# Altium schematic sheet BBB-Headers.SchDoc: Set in Document Options » Parameters » Title
size Tabloid; Author: Set in Document Options » Parameters » Author + Contact info
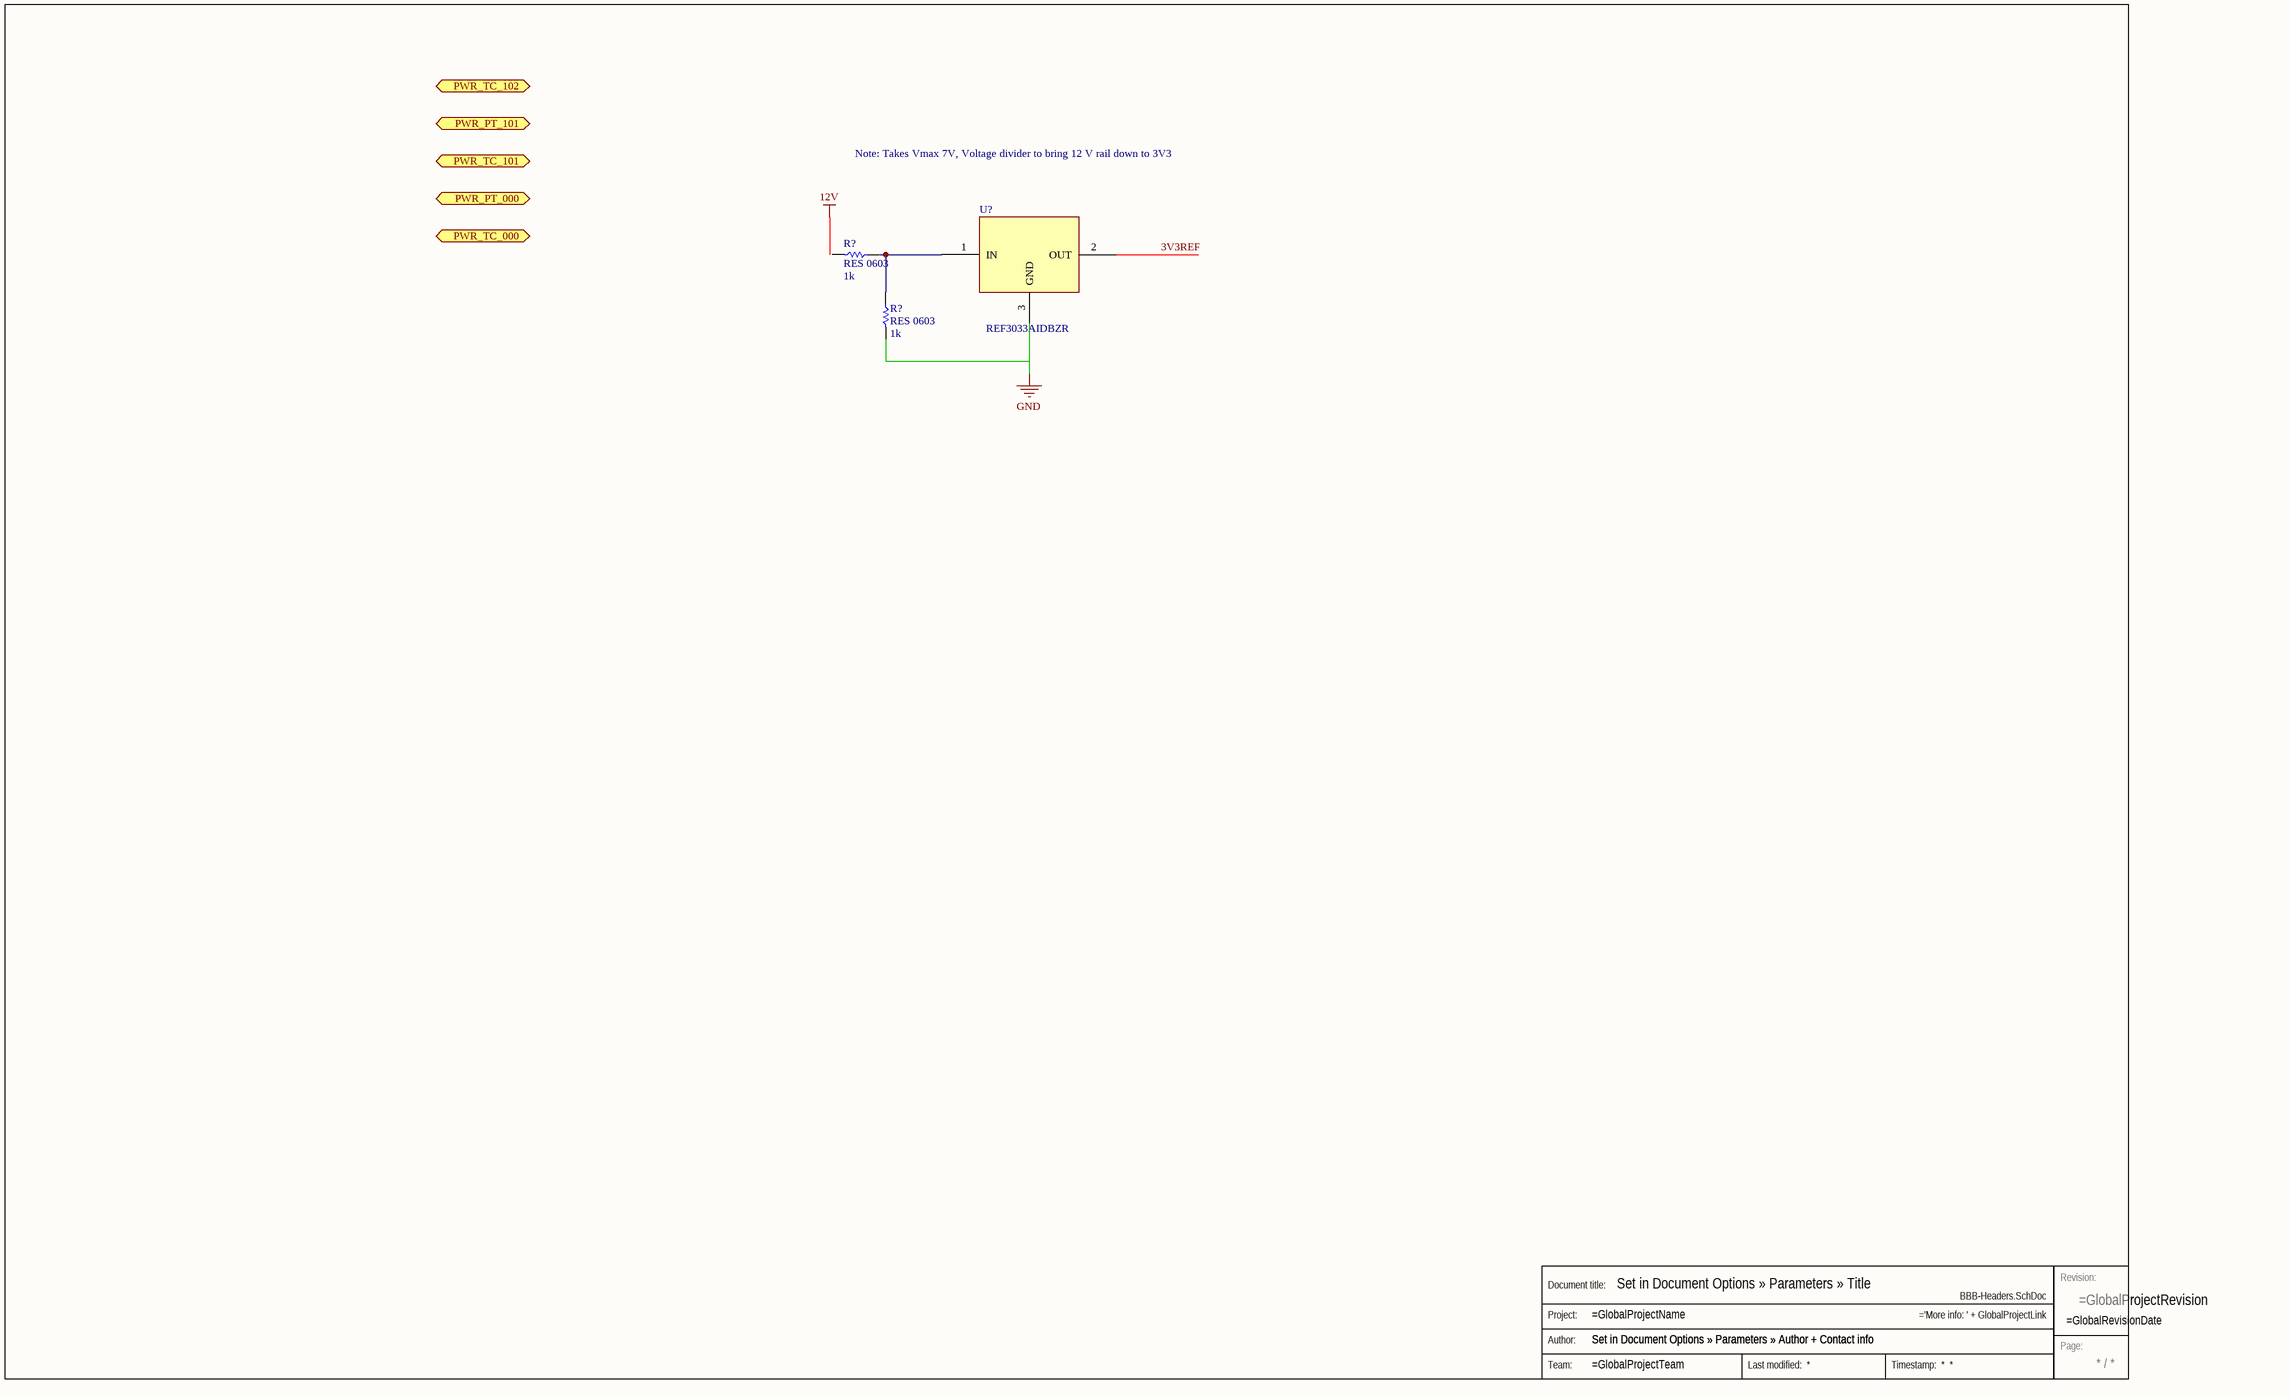
[diagram p0: BBB-Headers.SchDoc]

## Parts
(Parts that share a designator on the sheet are numbered #1, #2 ... from top to bottom, then left to right.)
R?#1  RES 0603  Value (Ohms): 1k  [RES 0603]
R?#2  RES 0603  Value (Ohms): 1k  [RES 0603]
Stamp  Stamp  (value not drawn)  (graphical)
U?  REF3033AIDBZR  [SOT95P282X145-3N]

## Ports
PWR_PT_000, PWR_PT_101, PWR_TC_000, PWR_TC_101, PWR_TC_102

## Nets
NetR?#1_2: R?#1.2 R?#2.2 U?.1(IN)

Not connected (* = marked no-connect by the designer): R?#1 1; R?#2 1; U? 2(OUT) 3(GND)

## Buses and harness runs
bus 3V3REF

## Notes on the sheet
- Note: Takes Vmax 7V, Voltage divider to bring 12 V rail down to 3V3
- Labels drawn without touching a wire or pin: 12V, GND
- (in symbol Stamp) Revision:; Document title:; Project:; Author:; Page:; Team:

## Library data of the parts
U? = REF3033AIDBZR: Manufacturer: Texas Instrument; Digikey Link: https://www.digikey.com/product-detail/en/texas-instruments/REF3033AIDBZR/296-26324-1-ND/2254967; Digikey P/N: 296-26324-1-ND; Manufacturer P/N: REF3033AIDBZR
R?#1 R?#2 = RES 0603: PartNumber: *; Tolerance: *